# EAGLE design mathrax-touch (EAGLE 9.6.2)
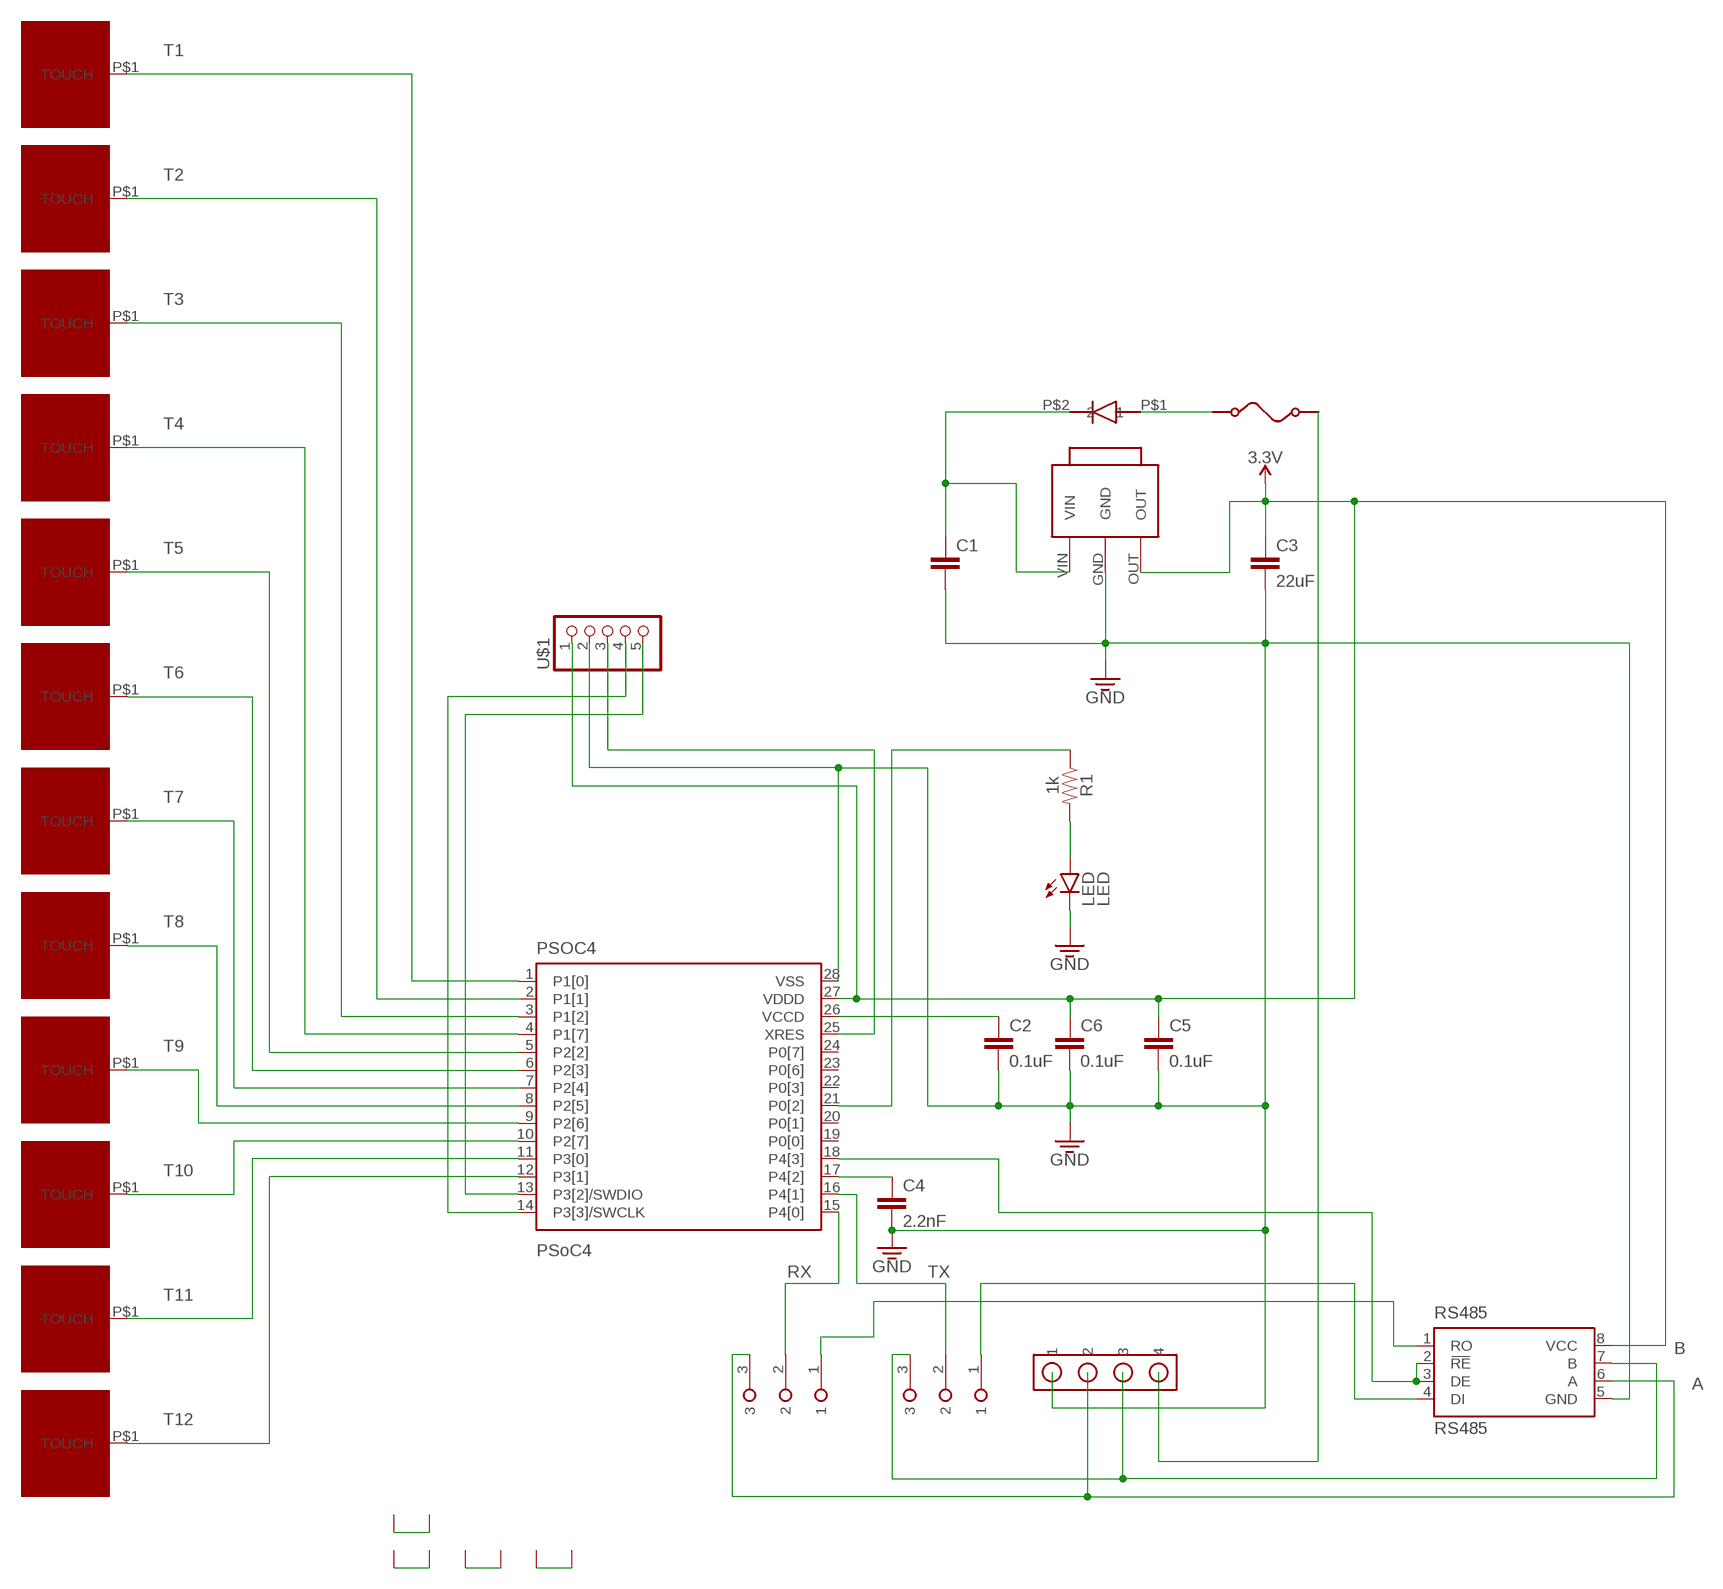
[diagram p0: schematic, sheet 1]

## Parts
C1  0.33uF  0.1UF-3216  [3216]
C2  0.1uF  0.1UF-0603-25V-(+80/-20%)  [0603]
C3  22uF  22UF-1210-16V-20%  [1210]
C4  2.2nF  2.2NF/2200PF-0603-50V-10%  [0603]
C5  0.1uF  0.1UF-0603-25V-(+80/-20%)  [0603]
C6  0.1uF  0.1UF-0603-25V-(+80/-20%)  [0603]
F1  H1  POLY-SWITCH-HUSE  [RESETABLE-HUES]
LED  LED  LEDCHIPLED_0805  [CHIPLED_0805]
PSOC4  PSoC4  CY8C4245PVI-482-28  [SSOP28]
R1  1k  1KOHM-0603-1/10W-1%  [0603]
RS485  RS485  [SOIC127P600X175-8N]
U$1  PINHEADER-5  [PINHEADER-5L]
U$2  TOUCH-PTN-3  [TOUCH-PTN3]
U$3  TOUCH-PTN-2  [TOUCH-PTN2]
U$4  TOUCH-PTN-2  [TOUCH-PTN2]
U$5  TOUCH-PTN-2  [TOUCH-PTN2]
U$6  TOUCH-PTN-2  [TOUCH-PTN2]
U$7  TOUCH-PTN-2  [TOUCH-PTN2]
U$8  TOUCH-PTN-2  [TOUCH-PTN2]
U$9  TOUCH-PTN-2  [TOUCH-PTN2]
U$11  EH4-UART  [EH4-UART]
U$13  REGULATOR-TO252-3  [BA33BC0FP]
U$18  TOUCH-PTN-2  [TOUCH-PTN2]
U$19  TOUCH-PTN-2  [TOUCH-PTN2]
U$20  TOUCH-PTN-2  [TOUCH-PTN2]
U$21  TOUCH-PTN-1  [TOUCH-PTN1]
U$22  DIODE-SS2040L  [DIODE-SS2040L]
U$23  JUMPER  [JUMPER]
U$24  JUMPER  [JUMPER]
U$25  M-LOGO  [M-LOGO]
U$27  MATHRAX-LOGO  [MATHRAX-LOGO]

## Nets
3.3V: C3.1 C5.1 C6.1 PSOC4.27(VDDD) RS485.8(VCC) U$1.1 U$13.OUT
A: RS485.6(A) U$11.2 U$24.3
B: RS485.7(B) U$11.3 U$23.3
CLK: PSOC4.14(P3[3]/SWCLK) U$1.4
DAT: PSOC4.13(P3[2]/SWDIO) U$1.5
GND: C1.P$2 C2.2 C3.2 C4.2 C5.2 C6.2 LED.C PSOC4.28(VSS) RS485.5(GND) U$1.2 U$11.1 U$13.GND
LED: PSOC4.21(P0[2]) R1.1
N$5: F1.1 U$22.P$1
N$6: U$25.P$1 U$25.P$2
N$7: U$27.1 U$27.2
N$8: U$27.3 U$27.4
N$9: U$27.5 U$27.6
N$15: LED.A R1.2
N$16: C4.1 PSOC4.17(P4[2])
N$20: C2.1 PSOC4.26(VCCD)
N$25: C1.P$1 U$13.VIN U$22.P$2
RS485-CE: PSOC4.18(P4[3]) RS485.2(RE) RS485.3(DE)
RST: PSOC4.25(XRES) U$1.3
RX: PSOC4.15(P4[0]) U$24.2
RX-485: RS485.1(RO) U$24.1
T1: PSOC4.1(P1[0]) U$21.P$1(TOUCH)
T2: PSOC4.2(P1[1]) U$20.P$1(TOUCH)
T3: PSOC4.3(P1[2]) U$19.P$1(TOUCH)
T4: PSOC4.4(P1[7]) U$18.P$1(TOUCH)
T5: PSOC4.5(P2[2]) U$9.P$1(TOUCH)
T6: PSOC4.6(P2[3]) U$8.P$1(TOUCH)
T7: PSOC4.7(P2[4]) U$7.P$1(TOUCH)
T8: PSOC4.8(P2[5]) U$6.P$1(TOUCH)
T9: PSOC4.9(P2[6]) U$5.P$1(TOUCH)
T10: PSOC4.10(P2[7]) U$4.P$1(TOUCH)
T11: PSOC4.11(P3[0]) U$3.P$1(TOUCH)
T12: PSOC4.12(P3[1]) U$2.P$1(TOUCH)
TX: PSOC4.16(P4[1]) U$23.2
TX-485: RS485.4(DI) U$23.1
VIN: F1.2 U$11.4
Unconnected: PSOC4.19(P0[0]) PSOC4.20(P0[1]) PSOC4.22(P0[3]) PSOC4.23(P0[6]) PSOC4.24(P0[7])

## Library data of the parts
C1 = Capacitors-mathrax:0.1UF: 0.1µF ceramic capacitors A capacitor is a passive two-terminal electrical component used to store electrical energy temporarily in an electric field.
C2 C5 C6 = Capacitors-mathrax:0.1UF: 0.1µF ceramic capacitors A capacitor is a passive two-terminal electrical component used to store electrical energy temporarily in an electric field.; PROD_ID: CAP-00810
C3 = Capacitors-mathrax:22UF: 22µF ceramic capacitors A capacitor is a passive two-terminal electrical component used to store electrical energy temporarily in an electric field.
C4 = Capacitors-mathrax:2.2NF/2200PF: 2.2nF/2,200pF ceramic capacitors A capacitor is a passive two-terminal electrical component used to store electrical energy temporarily in an electric field.; PROD_ID: CAP-07877
F1 = Mathrax:POLY-SWITCH
LED = Mathrax-led:LED: LED OSRAM: - CHIPLED LG R971, LG N971, LY N971, LG Q971, LY Q971, LO R971, LY R971 LH N974, LH R974 LS Q976, LO Q976, LY Q976 LO Q996 - Hyper CHIPLED LW Q18S LB Q993, LB Q99A, LB R99A - SideLED LS A670, LO A670, LY A670, LG A670, LP A670 LB A673, LV A673, LT A673, LW A673 LH A674 LY A675 LS A676, LA A676, LO A676, LY A676, LW A676 LS A679, LY A679, LG A679 - Hyper Micro SIDELED® LS Y876, LA Y876, LO Y876, LY Y876 LT Y87S - SmartLED LW L88C, LW L88S LB L89C, LB L89S, LG L890 LS L89K, LO L89K, LY L89K LS L896, LA L896, LO L896, LY L896 - TOPLED LS T670, LO T670, LY T670, LG T670, LP T670 LSG T670, LSP T670, LSY T670, LOP T670, LYG T670 LG T671, LOG T671, LSG T671 LB T673, LV T673, LT T673, LW T673 LH T674 LS T676, LA T676, LO T676, LY T676, LB T676, LH T676, LSB T676, LW T676 LB T67C, LV T67C, LT T67C, LS T67K, LO T67K, LY T67K, LW E67C LS E67B, LA E67B, LO E67B, LY E67B, LB E67C, LV E67C, LT E67C LW T67C LS T679, LY T679, LG T679 LS T770, LO T770, LY T770, LG T770, LP T770 LB T773, LV T773, LT T773, LW T773 LH T774 LS E675, LA E675, LY E675, LS T675 LS T776, LA T776, LO T776, LY T776, LB T776 LHGB T686 LT T68C, LB T68C - Hyper Mini TOPLED® LB M676 - Mini TOPLED Santana® LG M470 LS M47K, LO M47K, LY M47K Source: http://www.osram.convergy.de LUXEON: - LUMILED® LXK2-PW12-R00, LXK2-PW12-S00, LXK2-PW14-U00, LXK2-PW14-V00 LXK2-PM12-R00, LXK2-PM12-S00, LXK2-PM14-U00 LXK2-PE12-Q00, LXK2-PE12-R00, LXK2-PE12-S00, LXK2-PE14-T00, LXK2-PE14-U00 LXK2-PB12-K00, LXK2-PB12-L00, LXK2-PB12-M00, LXK2-PB14-N00, LXK2-PB14-P00, LXK2-PB14-Q00 LXK2-PR12-L00, LXK2-PR12-M00, LXK2-PR14-Q00, LXK2-PR14-R00 LXK2-PD12-Q00, LXK2-PD12-R00, LXK2-PD12-S00 LXK2-PH12-R00, LXK2-PH12-S00 LXK2-PL12-P00, LXK2-PL12-Q00, LXK2-PL12-R00 Source: www.luxeon.com KINGBRIGHT: KA-3528ASYC Source: www.kingbright.com
PSOC4 = mathrax-cypress:CY8C4245PVI-482: PSoC® Programmable System-on-Chip? M8C Processor Speeds to 24 MHz
R1 = Mathrax-Resistors:1KOHM: 1kΩ resistor A resistor is a passive two-terminal electrical component that implements electrical resistance as a circuit element. Resistors act to reduce current flow, and, at the same time, act to lower voltage levels within circuits. - Wikipedia; PROD_ID: RES-07856
RS485 = Mathrax:RS485
U$1 = Mathrax:PINHEADER-5
U$2-U$9 U$18-U$21 = Mathrax-touch:TOUCH-PTN
U$11 = Mathrax:EH4
U$13 = Mathrax:REGULATOR
U$22 = Mathrax:DIODE
U$23 U$24 = Mathrax:JUMPER
U$25 = Mathrax:M-LOGO
U$27 = Mathrax:MATHRAX-LOGO

## Board
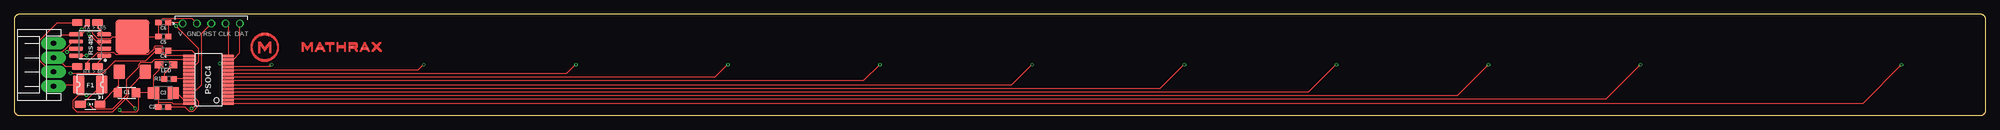
[diagram p1: board, top side]
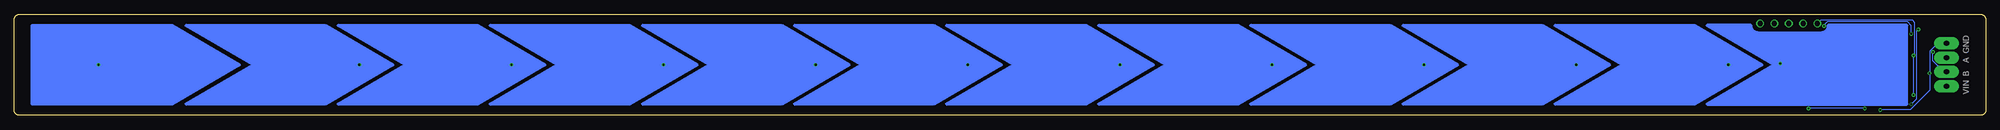
[diagram p2: board, bottom side, seen from below]

Size 350 x 18 mm. Coordinates in mm from the lower left corner, seen from the top.
Outline: 349,18 1,18 0.9,18 0.8,17.98 0.7,17.95 0.61,17.92 0.52,17.88 0.44,17.83 0.36,17.77 0.29,17.71 0.23,17.64 0.17,17.56 0.12,17.48 0.08,17.39 0.04,17.3 0.02,17.2 0.01,17.1 0,17 0,1 0.01,0.9 0.02,0.8 0.04,0.7 0.08,0.61 0.12,0.52 0.17,0.44 0.23,0.36 0.29,0.29 0.36,0.23 0.44,0.17 0.52,0.12 0.61,0.08 0.7,0.04 0.8,0.02 0.9,0.01 1,0 349,0 349.1,0.01 349.2,0.02 349.3,0.04 349.39,0.08 349.48,0.12 349.56,0.17 349.64,0.23 349.71,0.29 349.77,0.36 349.83,0.44 349.88,0.52 349.92,0.61 349.95,0.7 349.98,0.8 350,0.9 350,1 350,17 350,17.1 349.98,17.2 349.95,17.3 349.92,17.39 349.88,17.48 349.83,17.56 349.77,17.64 349.71,17.71 349.64,17.77 349.56,17.83 349.48,17.88 349.39,17.92 349.3,17.95 349.2,17.98 349.1,18 349,18
Copper layers (1*16): Top 0.035mm / dielectric 1.6mm / Bottom 0.035mm
Design rules "Elecrow_2-layer_PCB_eagle_rule *": minimum track width 0.2mm, minimum drill 0.3mm, track to track 6mil, track to pad 6mil, pad to pad 6mil, via to via 8mil, smd to smd 0mil, copper to edge 20mil, drill to drill 10mil, minimum pad ring 6mil, minimum via ring 6mil, stop-mask expansion 0mil, vias tented up to drill 100mil, thermal gap 10mil

### Footprints (pad centres in the part's own frame; a part is rotated, then mirrored left to right if it is on the bottom)
3216 = smd 1.5 x 1.6: P$1 -1.6,0; P$2 1.6,0
0603 = smd 1.1 x 1: 1 -0.85,0; 2 0.85,0
1210 = smd 2 x 2: 1 -1.755,0; 2 1.755,0
RESETABLE-HUES = smd 2 x 3.15: 1 -2.032,0; 2 2.032,0
CHIPLED_0805 = smd 1.2 x 1.5: A 0,-1.25; C 0,1.25
SSOP28 = smd 0.38 x 2: 1 -4.225,-3.5; 2 -3.575,-3.5; 3 -2.925,-3.5; 4 -2.275,-3.5; 5 -1.625,-3.5; 6 -0.975,-3.5; 7 -0.325,-3.5; 8 0.325,-3.5; 9 0.975,-3.5; 10 1.625,-3.5; 11 2.275,-3.5; 12 2.925,-3.5; 13 3.575,-3.5; 14 4.225,-3.5; 15 4.225,3.5; 16 3.575,3.5; 17 2.925,3.5; 18 2.275,3.5; 19 1.625,3.5; 20 0.975,3.5; 21 0.325,3.5; 22 -0.325,3.5; 23 -0.975,3.5; 24 -1.625,3.5; 25 -2.275,3.5; 26 -2.925,3.5; 27 -3.575,3.5; 28 -4.225,3.5
SOIC127P600X175-8N = smd 2.5 x 0.65: 1 -2.5,1.905; 2 -2.5,0.635; 3 -2.5,-0.635; 4 -2.5,-1.905; 5 2.5,-1.905; 6 2.5,-0.635; 7 2.5,0.635; 8 2.5,1.905
PINHEADER-5L = drill 0.9: 1 -5.08,0; 2 -2.54,0; 3 0,0; 4 2.54,0; 5 5.08,0
TOUCH-PTN3 = drill 0.3 pad 0.6: P$1 0,-0.254
TOUCH-PTN2 = drill 0.3 pad 0.6: P$1 -17.78,0
EH4-UART = drill 0.9 pad 2.2 long: 1 -3.81,0; 2 -1.27,0; 3 1.27,0; 4 3.81,0
BA33BC0FP = smd 6 x 6: GND 0,5 | smd 2 x 2.5: OUT 2.3,-1.25; VIN -2.3,-1.25
TOUCH-PTN1 = drill 0.3 pad 0.6: P$1 0,0
DIODE-SS2040L = smd 2 x 1.27: P$1 -1.75,0; P$2 1.75,0
JUMPER = smd 1.9 x 1.27: 1 -1.8,0; 3 1.8,0 | smd 1 x 1.27: 2 0,0
M-LOGO = smd 0.2 x 0.2: P$1 -0.468,2.396; P$2 0.548,2.396
MATHRAX-LOGO = smd 0.25 x 0.25: 1 -4.108,-0.282; 2 -3.482,-0.282; 3 1.465,-0.062; 4 1.865,-0.062; 5 3.685,-0.282; 6 4.625,-0.282

### Placement (x,y rotation side)
C1  20,4 0 top
C2  26.5,1.5 180 top
C3  26.5,4 180 top
C4  26.5,11.5 180 top
C5  26.5,14 180 top
C6  26.5,16.5 180 top
F1  13.5,5.5 180 top
LED  27,9 90 top
PSOC4  34.5,6.35 90 top
R1  27.5,6.5 180 top
RS485  13.5,12.5 180 top
U$1  35,16.33 0 top
U$2  36.5,9 180 bottom
U$3  63.5,9 180 bottom
U$4  90.5,9 180 bottom
U$5  117.5,9 180 bottom
U$6  144.5,9 180 bottom
U$7  171.5,9 180 bottom
U$8  198.5,9 180 bottom
U$9  225.5,9 180 bottom
U$11  7,9 270 top
U$13  21,9 0 top
U$18  252.5,9 180 bottom
U$19  279.5,9 180 bottom
U$20  306.5,9 180 bottom
U$21  335,9 180 bottom
U$22  13.5,2 0 top
U$23  13,16.5 180 top
U$24  13,8.7 180 top
U$25  44.5,12 0 top
U$27  58.09,12.17 0 top

### Tracks (layer width: path | path; a pad name or v marks a point on that pad's centre or on a via)
3.3V  (via drill 0.3)
  Top 0.2: C3.1 28.88,4 30,2.88 30.9,2.88 PSOC4.27 31,2.75 32,2.75 32.38,2.38 32.38,1.88 31.75,1.25 v31.5,1.25 | 27.38,16.5 27.38,14 C5.1 | 27.38,16.5 C6.1 | v12.88,10.62 11,10.62 RS485.8 | 19.81,2.94 17.5,0.62 11.12,0.62 10.38,1.38 10.38,2.62 11.38,3.62 v12.88,3.62 | 19.81,2.94 20.25,3.38 20.25,4.7 U$13.OUT | 19.81,2.94 v21.5,1.25 | U$1.1 29.75,16.5 27.38,16.5
  Bottom 0.2: v12.88,3.62 v12.88,10.62 12.7,10.8 12.7,16.57 13.1,16.98 29.27,16.98 U$1.1 | v21.5,1.25 v31.5,1.25
A
  Top 0.2: 7.5,10.25 7,10.25 U$11.2 7.5,10.25 | 7.5,10.25 10.38,13.12 RS485.6 | 7.5,10.25 9.05,8.7 U$24.3
B  (via drill 0.3)
  Top 0.2: v9.38,11.25 9.88,11.75 11,11.75 RS485.7 | U$11.3 6.98,7.75 6.51,7.75 4.55,9.71 4.55,13.37 7.68,16.5 U$23.3
  Bottom 0.2: U$11.3 7.02,7.75 7.49,7.75 9.45,9.71 9.45,11.17 v9.38,11.25
CLK
  Top 0.2: U$1.4 38,15.87 PSOC4.14
DAT
  Top 0.2: U$1.5 40,16.25 40,11.05 38.95,10 38.08,10 PSOC4.13
GND  (via drill 0.3)
  Top 0.2: 25.62,14 U$13.GND 17.5,14 17.25,13.75 14.75,13.75 13.88,14.62 13.88,14.75 13.5,15.12 12.75,15.12 12.12,14.5 11,14.5 RS485.5 10.97,14.38 8.56,14.38 U$11.1 | 25.62,14 C5.2 | 25.62,2.38 25.62,3.12 C3.2 | 25.62,2.38 25.62,1.5 C2.2 | LED.C 25.75,8.12 24.75,7.12 C3.2 | C3.2 22.12,4 | 22.12,4 C1.P$2 | PSOC4.28 28.25,2.12 28,2.38 25.62,2.38 | C4.2 25.12,11.5 23.38,9.75 18,9.75 15.75,7.5 v10,7.5 | 25.62,14 25.62,16.48 C6.2 25.75,16.5 26.51,17.26 31.53,17.26 U$1.2 | v18.75,1 19.05,0.69 21.73,0.69 22.12,1.09 22.12,4
  Bottom 0.2: v18.75,1 13.46,1 10,4.46 v10,7.5 10,11.41 8.66,12.75 7.06,12.75 U$11.1
LED
  Top 0.2: PSOC4.21 30.82,6.5 R1.1
N$5
  Top 0.2: U$22.P$1 12.12,2 15.62,5.5 F1.1
N$6
  Top 0.2: U$25.P$1 U$25.P$2
N$7
  Top 0.2: U$27.1 U$27.2
N$8
  Top 0.2: U$27.3 U$27.4
N$9
  Top 0.2: U$27.5 U$27.6
N$15
  Top 0.2: LED.A 26.65,7.4 R1.2
N$16
  Top 0.2: PSOC4.17 31.1,9.38 31.98,9.38 32.25,9.65 32.25,10.85 31.6,11.5 C4.1
N$20
  Top 0.2: C2.1 30.38,1.5 31.18,0.69 31.73,0.69 32.73,1.69 32.73,2.57 31.93,3.38 31.05,3.38 PSOC4.26
N$25
  Top 0.2: 18.5,5.25 18.5,7.62 18.62,7.75 U$13.VIN | 18.5,5.25 18.5,4 C1.P$1 | 18.5,5.25 U$22.P$2
RS485-CE  (via drill 0.3)
  Top 0.2: 15.31,12.44 16,11.75 RS485.2 | 15.31,12.44 v13.25,14.5 | 15.31,12.44 RS485.3 | v28.75,15.88 32.73,11.9 32.73,9.48 31.88,8.62 PSOC4.18
  Bottom 0.2: v28.75,15.88 28.62,16 28.62,16.17 28.19,16.61 13.91,16.61 13.25,15.95 v13.25,14.5
RST
  Top 0.2: PSOC4.25 31.05,4.12 31.93,4.12 33.21,5.41 33.21,14.54 U$1.3
RX
  Top 0.2: PSOC4.15 30.95,10.62 26.82,10.62 26.5,10.94 26.5,12.06 26.3,12.25 25,12.25 24.75,12.01 24.75,11.74 23.75,10.75 18.13,10.75 17.7,11.17 14.74,11.17 13,9.43 U$24.2
RX-485
  Top 0.2: U$24.1 14.88,8.5 14.88,9.38 16,10.5 RS485.1
T1
  Top 0.2: PSOC4.1 328.12,2.12 U$21.P$1
T2
  Top 0.2: U$20.P$1 288.62,9 282.5,2.88 38.1,2.88 PSOC4.2
T3
  Top 0.2: U$19.P$1 261.62,9 256.12,3.5 38.08,3.5 PSOC4.3
T4
  Top 0.2: U$18.P$1 234.62,9 229.75,4.12 38.05,4.12 PSOC4.4
T5
  Top 0.2: U$9.P$1 207.62,9 203.38,4.75 38.02,4.75 PSOC4.5
T6
  Top 0.2: PSOC4.6 177,5.38 180.62,9 U$8.P$1
T7
  Top 0.2: U$7.P$1 153.62,9 150.75,6.12 38.1,6.12 PSOC4.7
T8
  Top 0.2: U$6.P$1 126.62,9 124.38,6.75 38.08,6.75 PSOC4.8
T9
  Top 0.2: U$5.P$1 99.62,9 98,7.38 38.05,7.38 PSOC4.9
T10
  Top 0.2: U$4.P$1 72.62,9 71.62,8 38.02,8 PSOC4.10
T11
  Top 0.2: PSOC4.11 45.25,8.62 45.62,9 U$3.P$1
T12
  Top 0.2: PSOC4.12 38,9.38 36.5,9.38 U$2.P$1
TX  (via drill 0.3)
  Top 0.2: U$23.2 13,16.25 v12,15.25 | PSOC4.16 30.95,9.88 24.88,9.88 24.38,9.38 22.43,9.38 22,8.94 22,8.5 19.88,6.38 19.88,3.57 17.42,1.11 14.14,1.11 v13.25,2
  Bottom 0.2: v12,15.25 12.25,15 12.25,3 v13.25,2
TX-485
  Top 0.2: U$23.1 14.88,16.5 14.88,15.62 16,14.5 RS485.4
VIN
  Top 0.2: U$11.4 7.31,5.5 F1.2

### Text on the board
tPlace: TX > 485 | V GND RST CLK DAT | RX > 485
bPlace: VIN B A GND